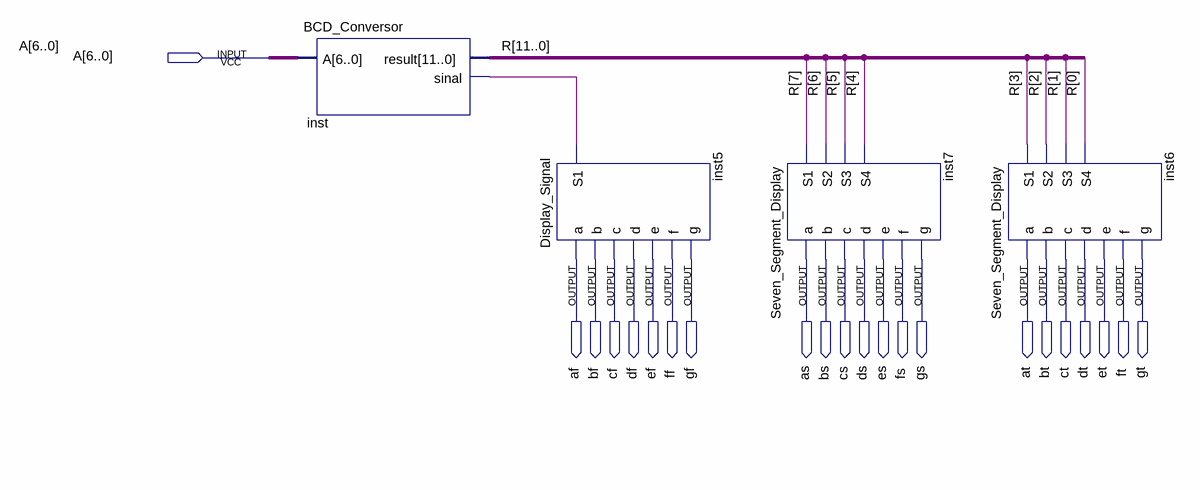
[diagram p0: schematic sheet]
// Quartus schematic Coversor_Seven_Segments.bdf as structural Verilog: 4 symbols, 22 pins
module Coversor_Seven_Segments (
  input  [6:0] A,
  output af,
  output bf,
  output cf,
  output df,
  output ef,
  output ff,
  output gf,
  output as,
  output bs,
  output cs,
  output ds,
  output es,
  output fs,
  output gs,
  output at,
  output bt,
  output ct,
  output dt,
  output et,
  output ft,
  output gt
);

  wire inst_sinal;
  wire [11:0] R;

  BCD_Conversor inst (.A(A), .result(R), .sinal(inst_sinal));
  Display_Signal inst5 (.S1(inst_sinal), .a(af), .b(bf), .c(cf), .d(df), .e(ef), .f(ff), .g(gf));
  Seven_Segment_Display inst7 (
    .S1(R[7]), .S2(R[6]), .S3(R[5]), .S4(R[4]), .a(as), .b(bs), .c(cs), .d(ds), .e(es), .f(fs), .g(gs));
  Seven_Segment_Display inst6 (
    .S1(R[3]), .S2(R[2]), .S3(R[1]), .S4(R[0]), .a(at), .b(bt), .c(ct), .d(dt), .e(et), .f(ft), .g(gt));
endmodule
